# EAGLE schematic atdh1150usb (EAGLE 6.6.0)

## Sheet 1 of 2
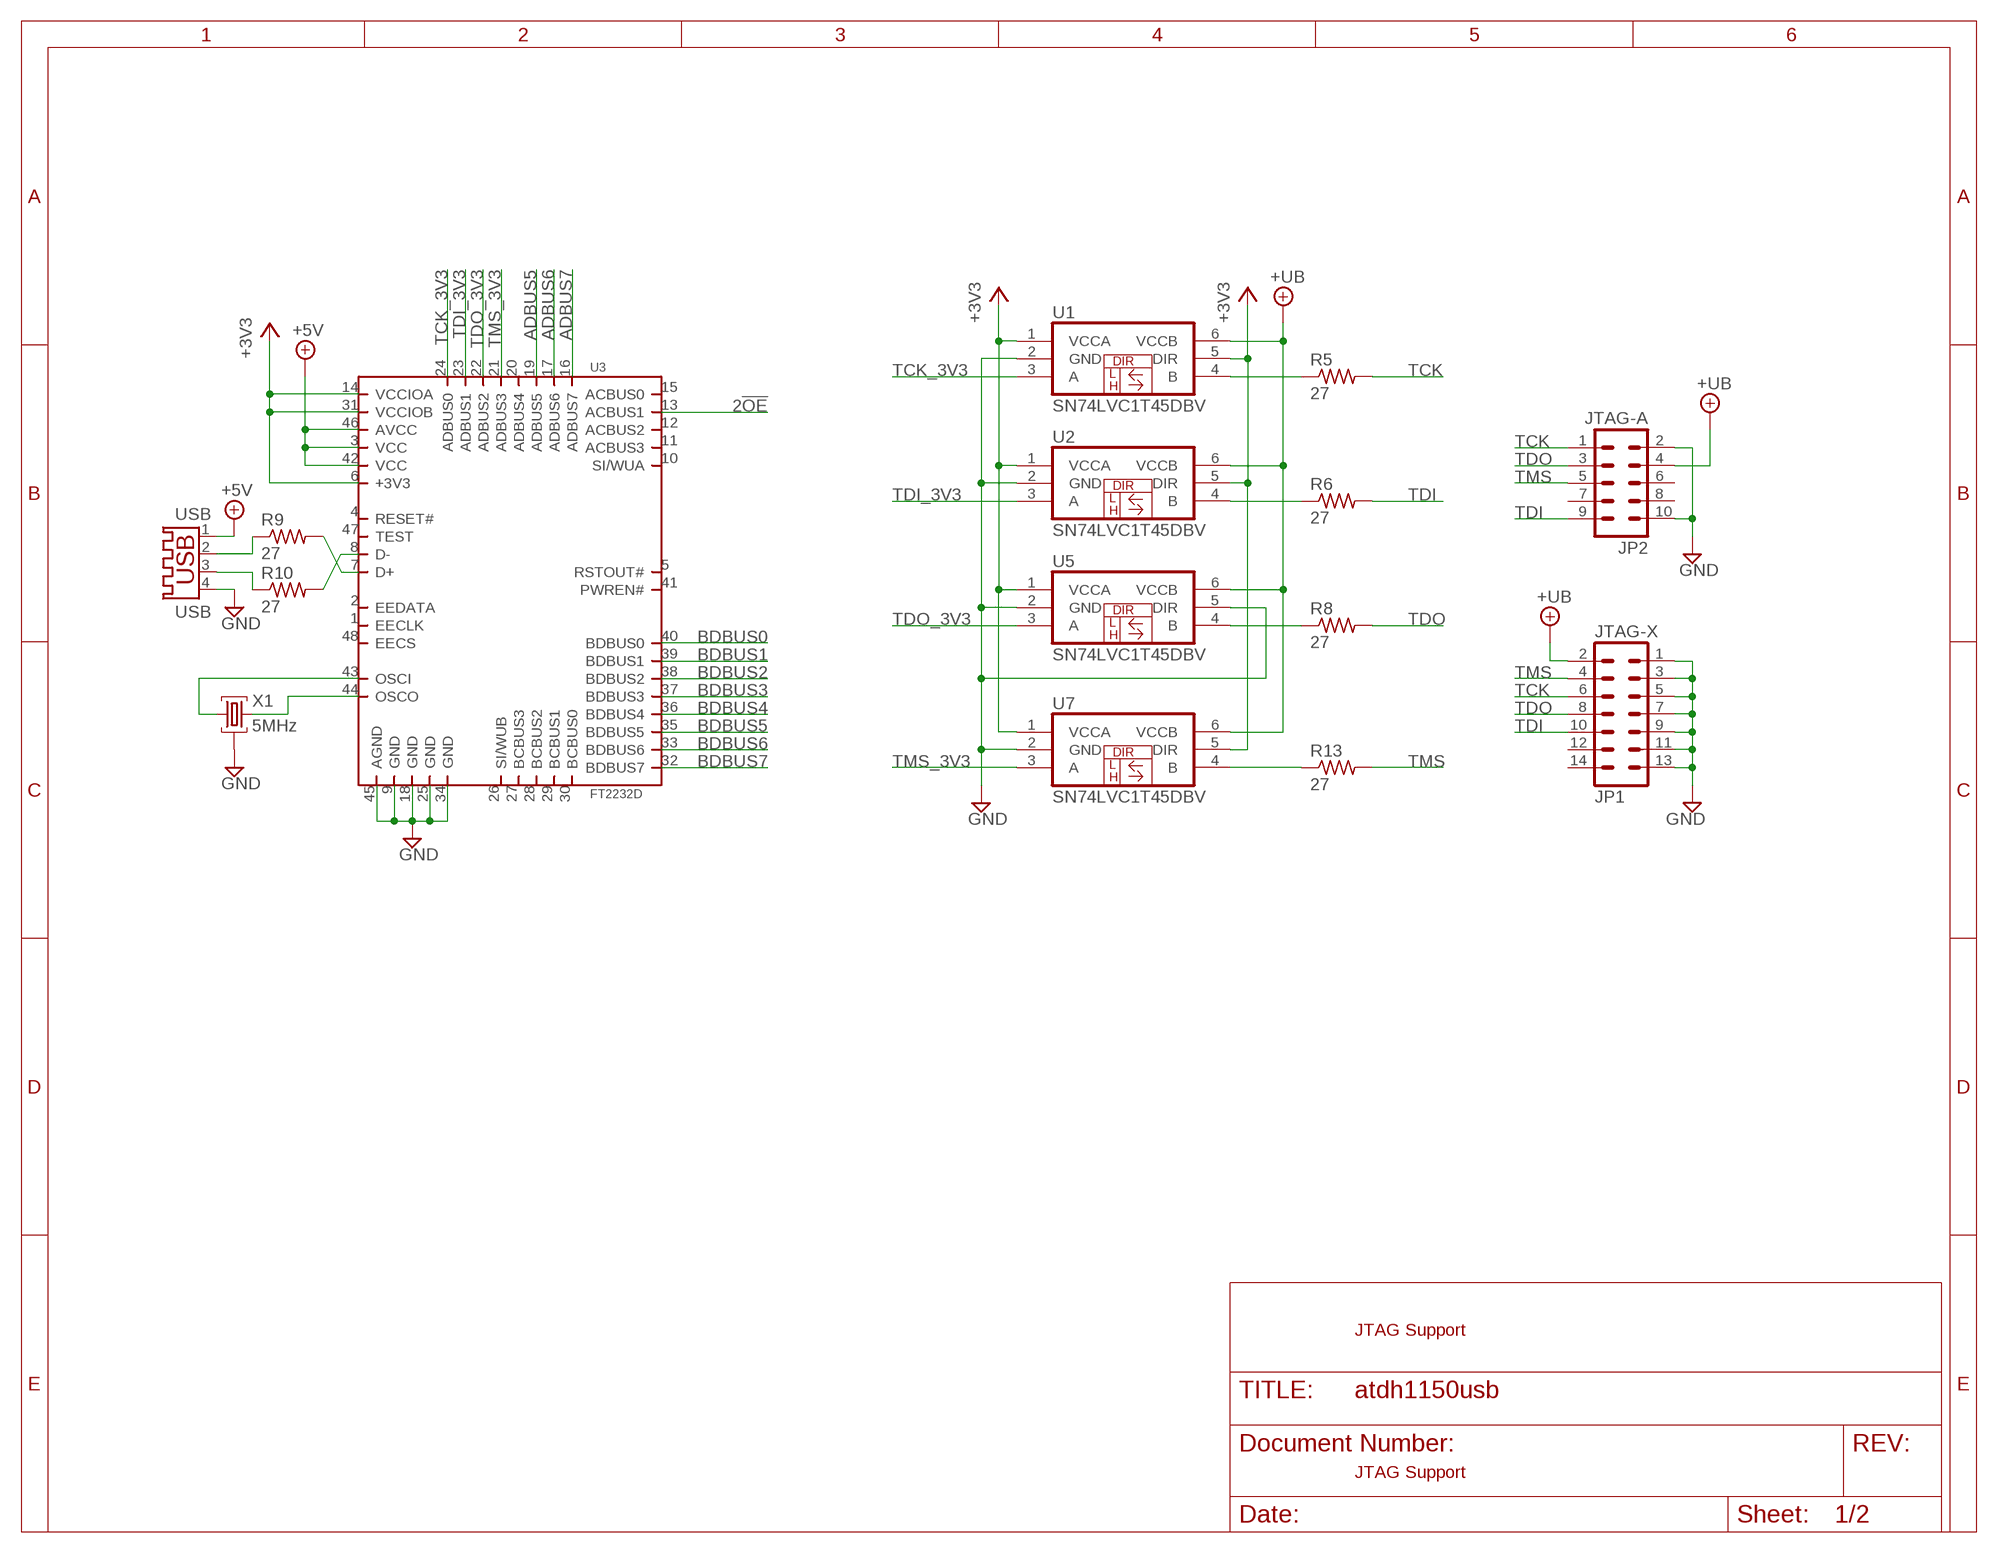
[diagram p0: schematic, sheet 1]

### Parts
JP1  JTAG-X  ML14  [ML14]
JP2  JTAG-A  ML10  [ML10]
R5  27  R-US_R0805  [R0805]
R6  27  R-US_R0805  [R0805]
R8  27  R-US_R0805  [R0805]
R9  27  R-US_R0805  [R0805]
R10  27  R-US_R0805  [R0805]
R13  27  R-US_R0805  [R0805]
U1  SN74LVC1T45DBV  IC_BUFF_SN74LVC1T45DBV  [DBV-R-PDSO-G6]
U2  SN74LVC1T45DBV  IC_BUFF_SN74LVC1T45DBV  [DBV-R-PDSO-G6]
U3  FT2232D  [LQFP48]
U5  SN74LVC1T45DBV  IC_BUFF_SN74LVC1T45DBV  [DBV-R-PDSO-G6]
U7  SN74LVC1T45DBV  IC_BUFF_SN74LVC1T45DBV  [DBV-R-PDSO-G6]
USB  USB  USB-A003  [USB-A003]
X1  5MHz  8M10AHC49T  [HC49U]

### Nets
2!OE: U3.13(ACBUS1) ; also sheet 2
+3V3: U1.1(VCCA) U1.5(DIR) U2.1(VCCA) U2.5(DIR) U3.6(+3V3) U3.14(VCCIOA) U3.31(VCCIOB) U5.1(VCCA) U7.1(VCCA) U7.5(DIR) ; also sheet 2
+5V: U3.3(VCC) U3.42(VCC) U3.46(AVCC) USB.1
+UB: JP1.2 JP2.4 U1.6(VCCB) U2.6(VCCB) U5.6(VCCB) U7.6(VCCB)
ADBUS5: U3.19(ADBUS5) ; also sheet 2
ADBUS6: U3.17(ADBUS6) ; also sheet 2
ADBUS7: U3.16(ADBUS7) ; also sheet 2
BDBUS0: U3.40(BDBUS0) ; also sheet 2
BDBUS1: U3.39(BDBUS1) ; also sheet 2
BDBUS2: U3.38(BDBUS2) ; also sheet 2
BDBUS3: U3.37(BDBUS3) ; also sheet 2
BDBUS4: U3.36(BDBUS4) ; also sheet 2
BDBUS5: U3.35(BDBUS5) ; also sheet 2
BDBUS6: U3.33(BDBUS6) ; also sheet 2
BDBUS7: U3.32(BDBUS7) ; also sheet 2
GND: JP1.1 JP1.3 JP1.5 JP1.7 JP1.9 JP1.11 JP1.13 JP2.2 JP2.10 U1.2(GND) U2.2(GND) U3.9(GND) U3.18(GND) U3.25(GND) U3.34(GND) U3.45(AGND) U5.2(GND) U5.5(DIR) U7.2(GND) USB.4 X1.2 ; also sheet 2
N$1: R9.1 USB.2
N$2: R10.1 USB.3
N$3: R10.2 U3.8(D-)
N$4: R9.2 U3.7(D+)
N$5: U3.44(OSCO) X1.3
N$6: U3.43(OSCI) X1.1
N$7: R5.1 U1.4(B)
N$8: R6.1 U2.4(B)
N$9: R8.1 U5.4(B)
N$10: R13.1 U7.4(B)
TCK: JP1.6 JP2.1 R5.2
TCK_3V3: U1.3(A) U3.24(ADBUS0) ; also sheet 2
TDI: JP1.10 JP2.9 R6.2
TDI_3V3: U2.3(A) U3.23(ADBUS1) ; also sheet 2
TDO: JP1.8 JP2.3 R8.2
TDO_3V3: U3.22(ADBUS2) U5.3(A) ; also sheet 2
TMS: JP1.4 JP2.5 R13.2
TMS_3V3: U3.21(ADBUS3) U7.3(A) ; also sheet 2
Unconnected: JP1.12 JP1.14 JP2.6 JP2.7 JP2.8 U3.1(EECLK) U3.2(EEDATA) U3.4(RESET#) U3.5(RSTOUT#) U3.10(SI/WUA) U3.11(ACBUS3) U3.12(ACBUS2) U3.15(ACBUS0) U3.20(ADBUS4) U3.26(SI/WUB) U3.27(BCBUS3) U3.28(BCBUS2) U3.29(BCBUS1) U3.30(BCBUS0) U3.41(PWREN#) U3.47(TEST) U3.48(EECS)

### Notes on the sheet
- JTAG Support
- JTAG Support

## Sheet 2 of 2
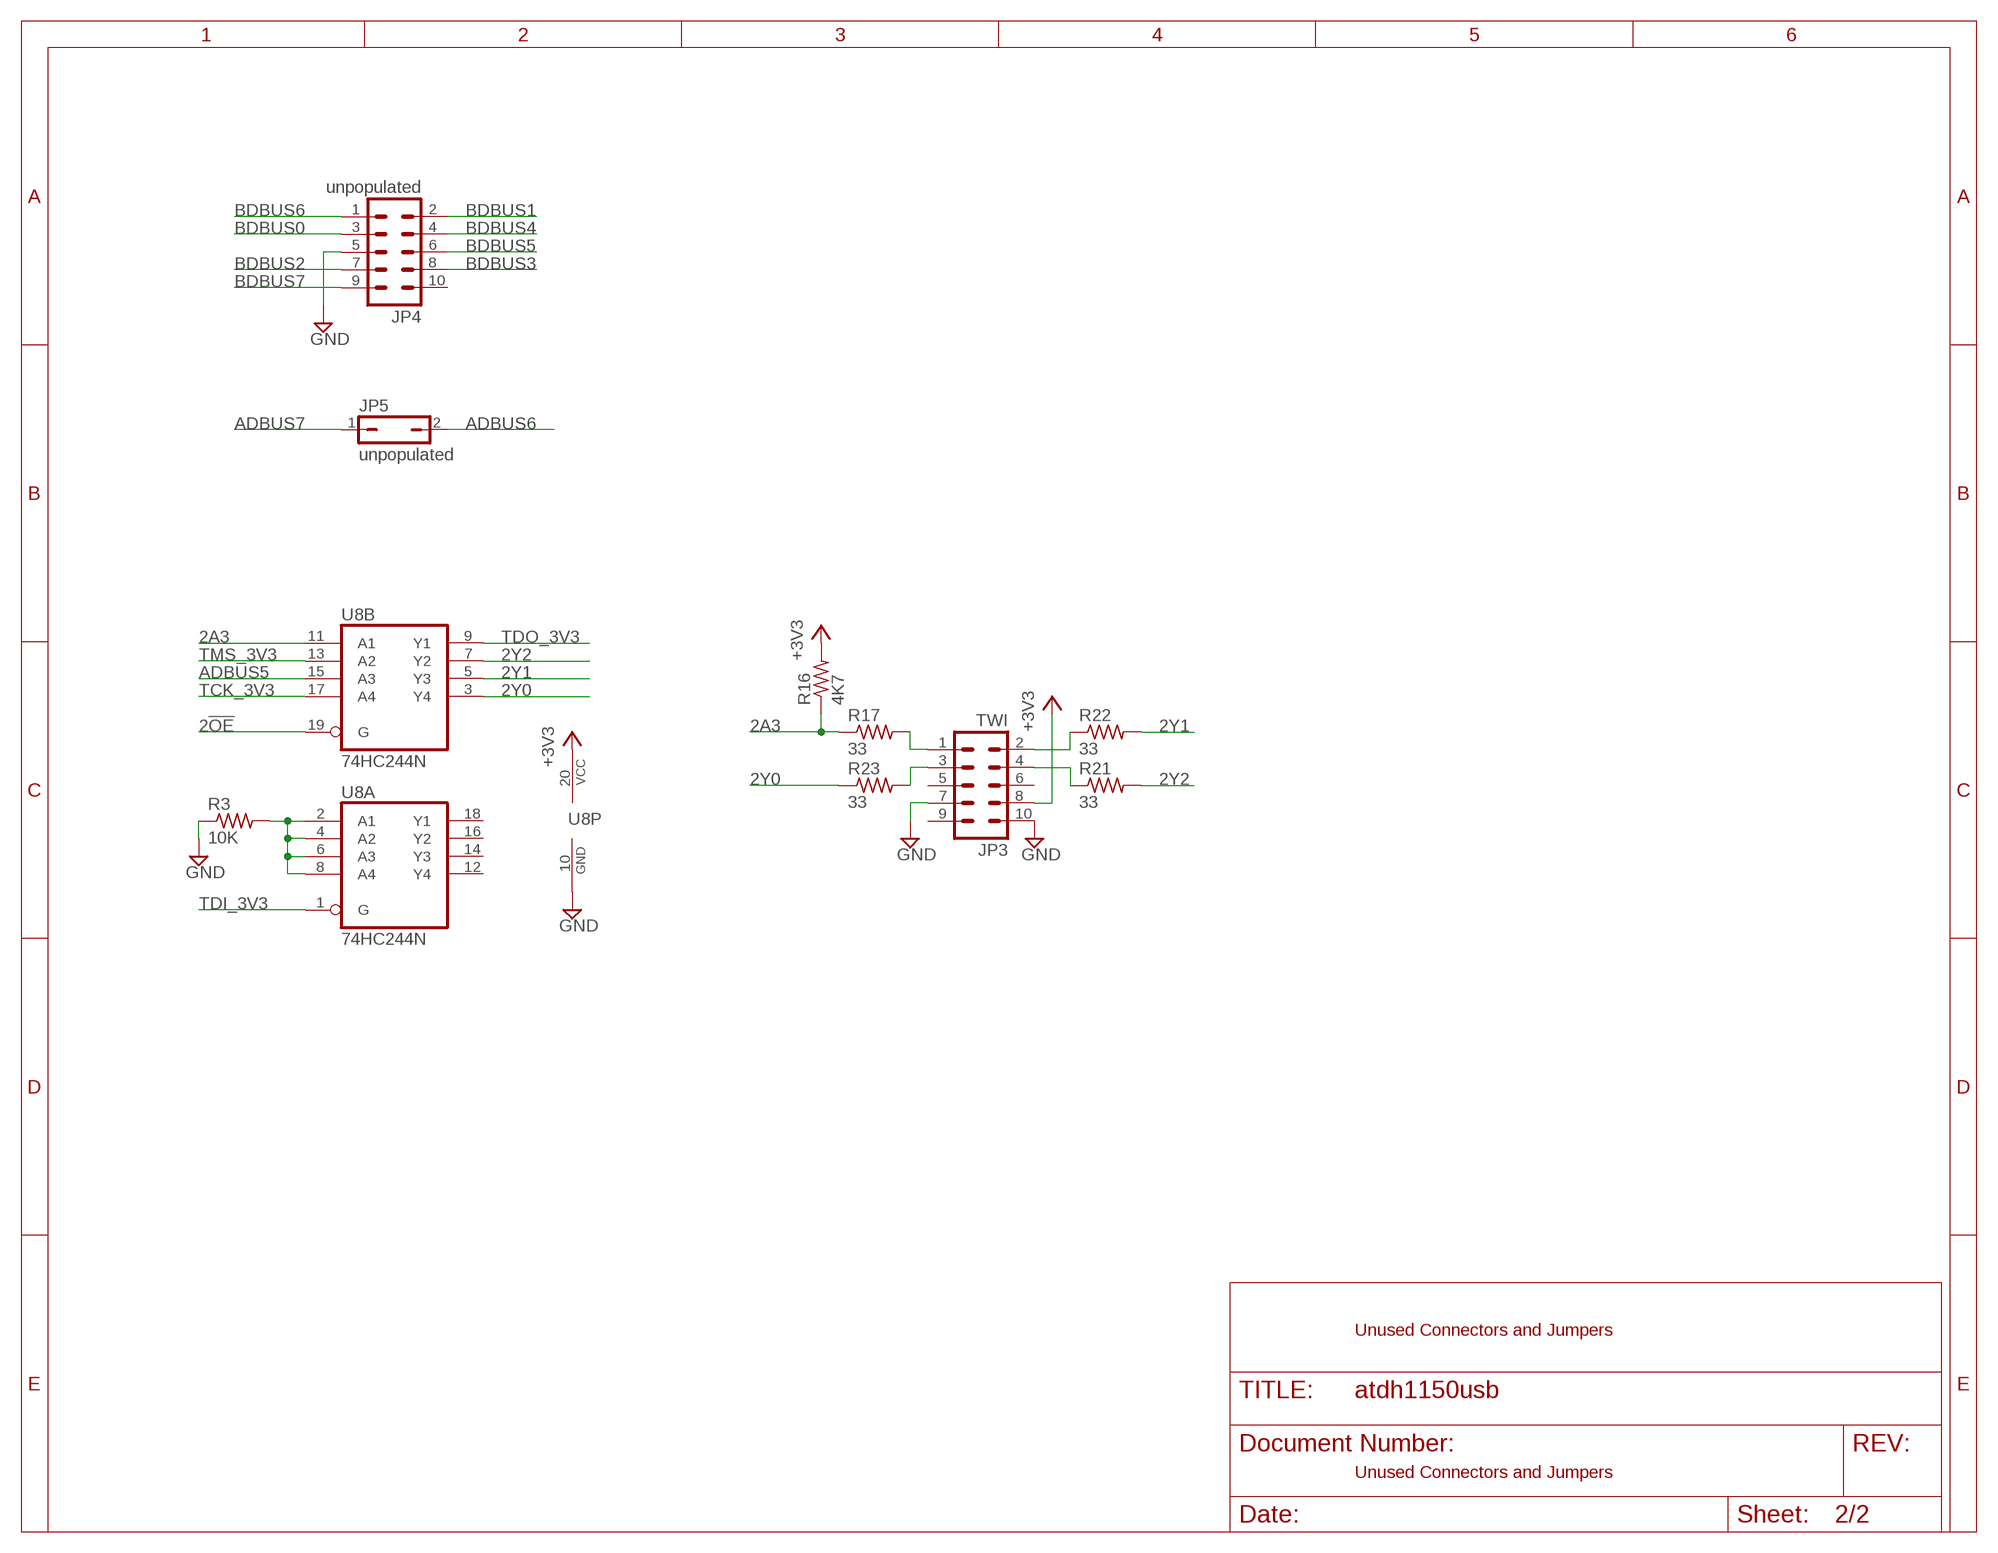
[diagram p1: schematic, sheet 2]

### Parts
JP3  TWI  ML10  [ML10]
JP4  unpopulated  ML10  [ML10]
JP5  unpopulated  JP1Q  [JP1]
R3  10K  R-US_R0805  [R0805]
R16  4K7  R-US_R0805  [R0805]
R17  33  R-US_R0805  [R0805]
R21  33  R-US_R0805  [R0805]
R22  33  R-US_R0805  [R0805]
R23  33  R-US_R0805  [R0805]
U8  74HC244N  74LS244N  [DIL20]

### Nets
2!OE: U8.19(B:G) ; also sheet 1
2A3: R16.1 R17.1 U8.11(B:A1)
2Y0: R23.1 U8.3(B:Y4)
2Y1: R22.2 U8.5(B:Y3)
2Y2: R21.2 U8.7(B:Y2)
+3V3: JP3.8 R16.2 U8.20(P:VCC) ; also sheet 1
ADBUS5: U8.15(B:A3) ; also sheet 1
ADBUS6: JP5.2 ; also sheet 1
ADBUS7: JP5.1 ; also sheet 1
BDBUS0: JP4.3 ; also sheet 1
BDBUS1: JP4.2 ; also sheet 1
BDBUS2: JP4.7 ; also sheet 1
BDBUS3: JP4.8 ; also sheet 1
BDBUS4: JP4.4 ; also sheet 1
BDBUS5: JP4.6 ; also sheet 1
BDBUS6: JP4.1 ; also sheet 1
BDBUS7: JP4.9 ; also sheet 1
GND: JP3.7 JP3.10 JP4.5 R3.1 U8.10(P:GND) ; also sheet 1
N$11: JP3.3 R23.2
N$12: JP3.1 R17.2
N$14: R3.2 U8.2(A:A1) U8.4(A:A2) U8.6(A:A3) U8.8(A:A4)
N$15: JP3.2 R22.1
N$16: JP3.4 R21.1
TCK_3V3: U8.17(B:A4) ; also sheet 1
TDI_3V3: U8.1(A:G) ; also sheet 1
TDO_3V3: U8.9(B:Y1) ; also sheet 1
TMS_3V3: U8.13(B:A2) ; also sheet 1
Unconnected: JP3.5 JP3.6 JP3.9 JP4.10 U8.12(A:Y4) U8.14(A:Y3) U8.16(A:Y2) U8.18(A:Y1)

### Notes on the sheet
- Unused Connectors and Jumpers
- Unused Connectors and Jumpers

## Library data of the parts
JP1 = con-harting-ml:ML14: HARTING; OC_FARNELL: unknown; OC_NEWARK: unknown
JP2-JP4 = con-harting-ml:ML10: HARTING; OC_FARNELL: unknown; OC_NEWARK: unknown
JP5 = jumper:JP1Q: JUMPER
R3 R5 R6 R8-R10 R13 R16 R17 R21-R23 = rcl:R-US_: RESISTOR, American symbol
U1 U2 U5 U7 = dp_devices:IC_BUFF_SN74LVC1T45DBV
U3 = ftdi:FT2232D
U8 = 74xx-us:74*244: Octal BUFFER and LINE DRIVER, 3-state
USB = con-yamaichi:USB-A003: USB connector; OC_FARNELL: unknown; OC_NEWARK: unknown
X1 = crystal:8M10AHC49T: Monolithic Crystal Filters Source: www.vanlong.com; OC_FARNELL: unknown; OC_NEWARK: unknown